# Altium schematic sheet ZLS_Signal_Conditioner.SchDoc
size Tabloid
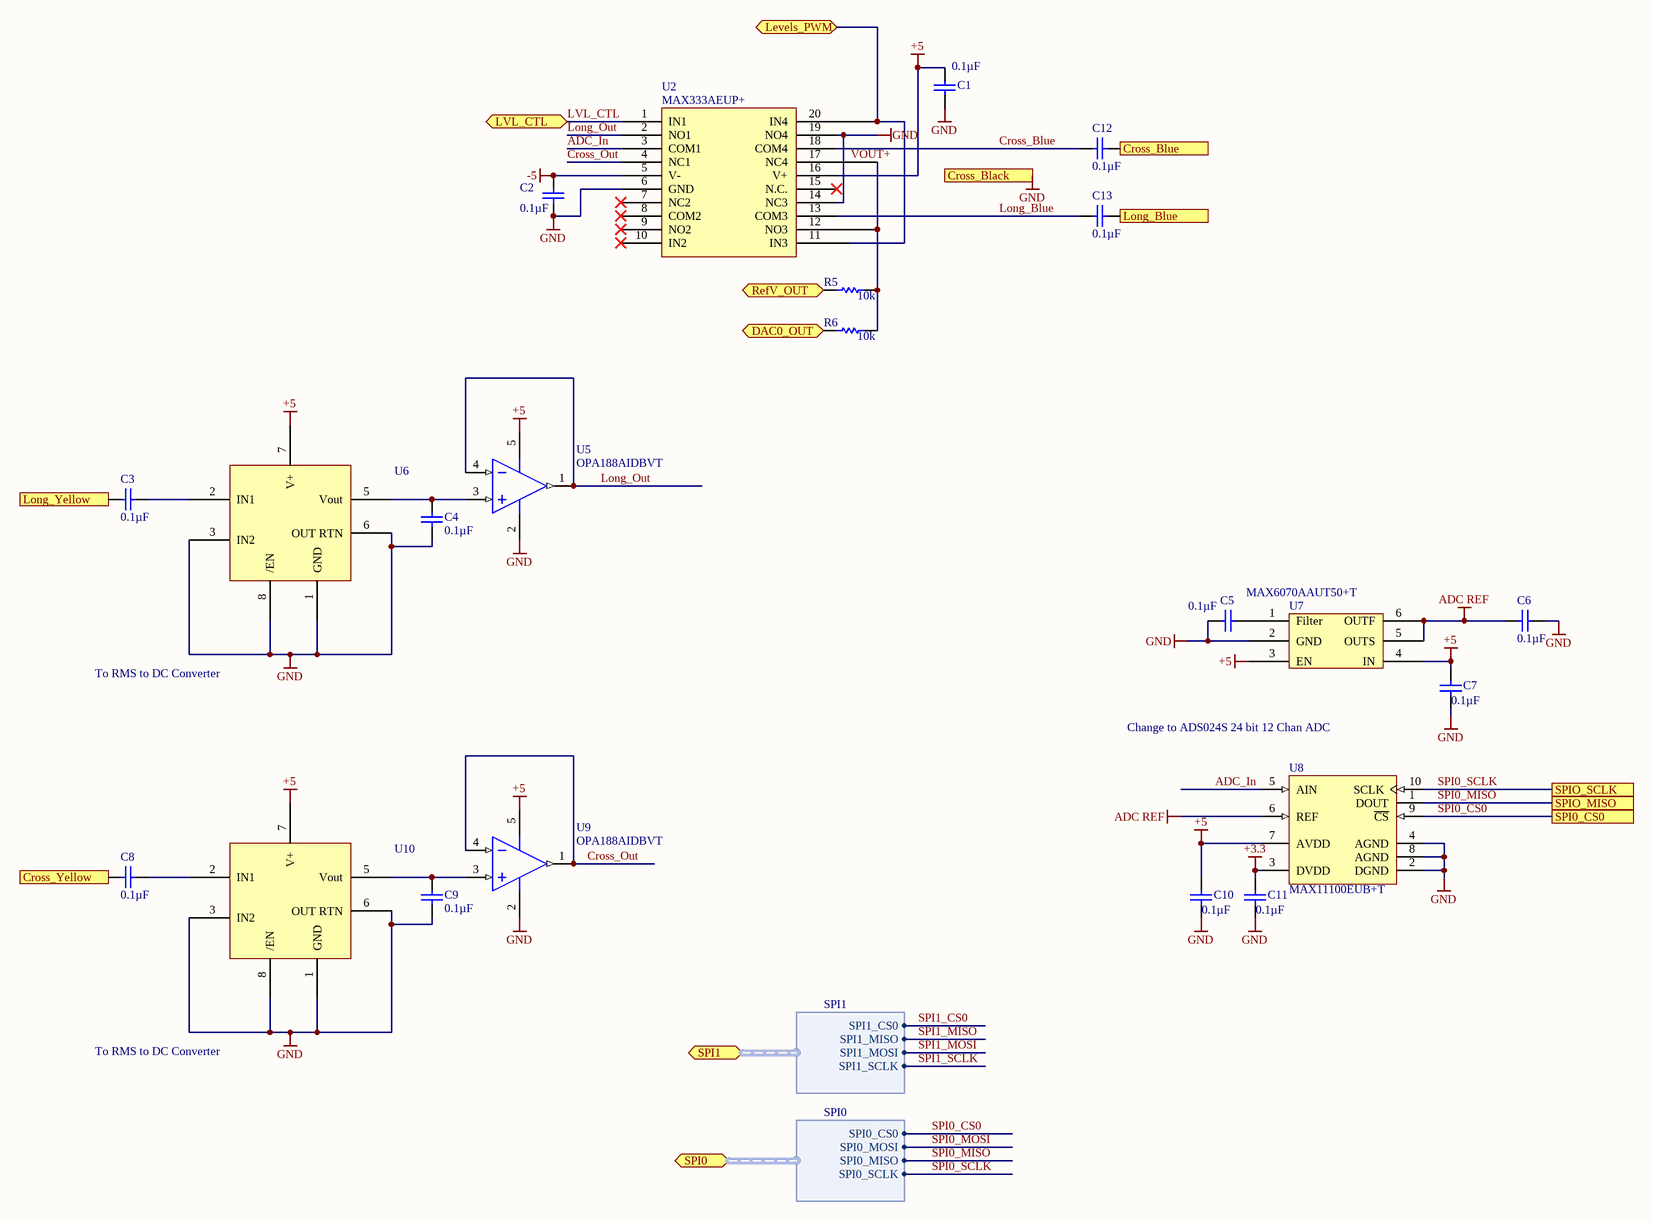
[diagram p0: ZLS_Signal_Conditioner.SchDoc]

## Parts
C1  Capacitance: 0.1µF  [CAPC0805(2012)145_N]  (hidden comment: CAP CER 0.1UF 25V X7R 0805)
C2  Capacitance: 0.1µF  [CAPC0805(2012)145_N]  (hidden comment: CAP CER 0.1UF 25V X7R 0805)
C3  Capacitance: 0.1µF  [CAPC0805(2012)145_N]  (hidden comment: CAP CER 0.1UF 25V X7R 0805)
C4  Capacitance: 0.1µF  [CAPC0805(2012)145_N]  (hidden comment: CAP CER 0.1UF 25V X7R 0805)
C5  Capacitance: 0.1µF  [CAPC0805(2012)145_N]  (hidden comment: CAP CER 0.1UF 25V X7R 0805)
C6  Capacitance: 0.1µF  [CAPC0805(2012)145_N]  (hidden comment: CAP CER 0.1UF 25V X7R 0805)
C7  Capacitance: 0.1µF  [CAPC0805(2012)145_N]  (hidden comment: CAP CER 0.1UF 25V X7R 0805)
C8  Capacitance: 0.1µF  [CAPC0805(2012)145_N]  (hidden comment: CAP CER 0.1UF 25V X7R 0805)
C9  Capacitance: 0.1µF  [CAPC0805(2012)145_N]  (hidden comment: CAP CER 0.1UF 25V X7R 0805)
C10  Capacitance: 0.1µF  [CAPC0805(2012)145_N]  (hidden comment: CAP CER 0.1UF 25V X7R 0805)
C11  Capacitance: 0.1µF  [CAPC0805(2012)145_N]  (hidden comment: CAP CER 0.1UF 25V X7R 0805)
C12  Capacitance: 0.1µF  [CAPC0805(2012)145_N]  (hidden comment: CAP CER 0.1UF 25V X7R 0805)
C13  Capacitance: 0.1µF  [CAPC0805(2012)145_N]  (hidden comment: CAP CER 0.1UF 25V X7R 0805)
R5  10k  [RESC0805(2012)_L]
R6  10k  [RESC0805(2012)_L]
U2  MAX333AEUP+  [TSOP65P640X90-20N]
U5  OPA188AIDBVT  [DBV0005A_L]
U6  LTC1967  [LTC1967]  (value not drawn)
U7  Supplier Part Number 1: MAX6070AAUT50+T  [SOT95P280X445-6N]  (hidden comment: MAX6070AAUT41+T)
U8  MAX11100EUB+T  [U10+2_L]
U9  OPA188AIDBVT  [DBV0005A_L]
U10  LTC1967  [LTC1967]  (value not drawn)

## Ports
Cross_Black, Cross_Blue, Cross_Yellow, DAC0_OUT, Levels_PWM, Long_Blue, Long_Yellow, LVL_CTL, RefV_OUT, SPI0 (harness SPI0), SPI0_CS0, SPI1 (harness SPI1), SPIO_MISO, SPIO_SCLK

## Harnesses
SPI1: SPI1_CS0, SPI1_MISO, SPI1_MOSI, SPI1_SCLK
SPI0: SPI0_CS0, SPI0_MOSI, SPI0_MISO, SPI0_SCLK

## Nets
+3.3: C11.1 U8.3(DVDD)
+5: C1.1 C7.1 C10.1 U2.16(V+) U5.5(V+) U6.7(V+) U7.3(EN) U7.4(IN) U8.7(AVDD) U9.5(V+) U10.7(V+)
-5: C2.1 U2.5(V-)
ADC REF: C6.1 U7.5(OUTS) U7.6(OUTF) U8.6(REF)
GND: C1.2 C2.2 C4.1 C5.1 C6.2 C7.2 C9.1 C10.2 C11.2 U2.6(GND) U2.14(NC3) U2.19(NO4) U5.2(V-) U6.1(GND) U6.3(IN2) U6.6(OUT_RTN) U6.8(/EN) U7.2(GND) U8.2(DGND) U8.4(AGND) U8.8(AGND) U9.2(V-) U10.1(GND) U10.3(IN2) U10.6(OUT_RTN) U10.8(/EN) ; port Cross_Black
ADC_In: U2.3(COM1) U8.5(AIN)
Cross_Blue: C12.1 U2.18(COM4)
Cross_Blue: C12.2 ; port Cross_Blue  [a separate net that carries the same name]
Cross_Out: U2.4(NC1) U9.1(OUT) U9.4(IN-)
Cross_Yellow: C8.1 ; port Cross_Yellow
DAC0_OUT: R6.1 ; port DAC0_OUT
Levels_PWM: U2.11(IN3) U2.20(IN4) ; port Levels_PWM
Long_Blue: C13.1 U2.13(COM3)
Long_Blue: C13.2 ; port Long_Blue  [a separate net that carries the same name]
Long_Out: U2.2(NO1) U5.1(OUT) U5.4(IN-)
Long_Yellow: C3.1 ; port Long_Yellow
LVL_CTL: U2.1(IN1) ; port LVL_CTL
RefV_OUT: R5.1 ; port RefV_OUT
SPI0_CS0: U8.9(~{CS}) ; port SPI0_CS0, port SPI0.SPI0_CS0
SPI0_MISO: U8.1(DOUT) ; port SPIO_MISO, port SPI0.SPI0_MISO
SPI0_MOSI: port SPI0.SPI0_MOSI
SPI0_SCLK: U8.10(SCLK) ; port SPIO_SCLK, port SPI0.SPI0_SCLK
SPI1_CS0: port SPI1.SPI1_CS0
SPI1_MISO: port SPI1.SPI1_MISO
SPI1_MOSI: port SPI1.SPI1_MOSI
SPI1_SCLK: port SPI1.SPI1_SCLK
VOUT+: R5.2 R6.2 U2.12(NO3) U2.17(NC4)
NetC3_2: C3.2 U6.2(IN1)
NetC4_2: C4.2 U5.3(IN+) U6.5(Vout)
NetC5_2: C5.2 U7.1(Filter)
NetC8_2: C8.2 U10.2(IN1)
NetC9_2: C9.2 U9.3(IN+) U10.5(Vout)

Not connected (* = marked no-connect by the designer): U2 7(NC2)* 8(COM2)* 9(NO2)* 10(IN2)* 15(N.C.)*; U6 4(NC); U10 4(NC)

## Notes on the sheet
- To RMS to DC Converter
- Change to ADS024S 24 bit 12 Chan ADC
- Title
- Size:
- Date:
- Tabloid
- Number:
- Time:
- Revision:
- Sheet
- of
- ZLS Corporation
- 7801 North Lamar Blvd.
- Suite E-184
- Austin, Texas 78752  USA
- (512) 453-0288
- File:

## Library data of the parts
C1-C13 = CMP-1036-04795-1: Manufacturer: Murata Electronics North America; Manufacturer Part Number: GRM21BR71E104KA01L; Tolerance: ±10%; Supplier 1: Digi-Key; Supplier Part Number 1: 490-1673-6-ND; RoHS: RoHS Compliant; Category: Capacitors; Stock 1: 891652; Pricing 1: 1=0.2, 10=0.145, 100=0.0683, 500=0.04788, 1000=0.03964 (USD); Packaging: Digi-Reel®; Part Status: Active; Voltage - Rated: 25V; Temperature Coefficient: X7R; Operating Temperature: -55°C ~ 125°C; Features: -; Ratings: -; Applications: General Purpose; Mounting Type: Surface Mount, MLCC; Package / Case: 0805 (2012 Metric); Size / Dimension: 0.079" L x 0.049" W (2.00mm x 1.25mm); Height - Seated (Max): -; Thickness (Max): 0.053" (1.35mm); Lead Spacing: -; Lead Style: -; ComponentLink1URL: http://www.murata.com/~/media/webrenewal/support/library/catalog/products/capacitor/mlcc/c02e.ashx; ComponentLink1Description: http://www.murata.com/~/media/webrenewal/support/library/catalog/products/capacitor/mlcc/c02e.ashx
R5 R6 = CMP-1013-00393-1: RES SMD 0 OHM 1% 1/8W 0805
U2 = MAX333CWP+: IC SWITCH QUAD SPDT 20TSSOP; Manufacturer: Maxim Integrated; Multiplexer/Demultiplexer Circuit: 2:1; On-State Resistance (Max): 45 Ohm; Channel-to-Channel Matching (&Delta;Ron): 2 Ohm (Max); Voltage - Supply, Single (V+): 10 V ~ 30 V; Voltage - Supply, Dual (V±): ±4.5 V ~ 20 V; Switch Time (Ton, Toff) (Max): 175ns, 145ns; Charge Injection: 2pC; Channel Capacitance (CS(off), CD(off)): 5pF; Current - Leakage (IS(off)) (Max): 250pA; Crosstalk: -78dB @ 1MHz; Supplier 1: Digi-Key; Supplier Part Number 1: MAX333AEUP+-ND; Manufacturer Part Number: MAX333AEUP+; RoHS: RoHS Compliant; Category: Integrated Circuits (ICs); Stock 1: 1328; Pricing 1: 1=6.77, 10=6.432, 25=6, 50=5.8942 (USD); Packaging: Tube; Part Status: Active; Switch Circuit: SPDT; -3db Bandwidth: -; Operating Temperature: -40°C ~ 85°C (TA); Package / Case: 20-TSSOP (0.173", 4.40mm Width); Supplier Device Package: 20-TSSOP; Base Part Number: MAX333; ComponentLink1URL: https://pdfserv.maximintegrated.com/en/ds/MAX333A.pdf; ComponentLink1Description: https://pdfserv.maximintegrated.com/en/ds/MAX333A.pdf
U5 U9 = CMP-0809-00006-2: Precision, Low Noise, Rail-to-Rail Output, Zero-Drift Operational Amplifier, 4 to 36 V, -40 to 125 degC, 5-pin SOT23 (DBV5), Green (RoHS & no Sb/Br); Manufacturer: Texas Instruments; Iq per channel(Max)(mA): 0.51; Total Supply Voltage(Max)(+5V is 5, +/-5V is 10): 36; GBW(Typ)(MHz): 2; SubFamily: Zero Drift Precision Amplifier; Rating: Catalog; CMRR(Min)(dB): 120; Number of Channels: 1; Slew Rate(Typ)(V/us): 0.8; Total Supply Voltage(Min)(+5V is 5, +/-5V is 10): 4; Offset Drift(Typ)(uV/C): 0.03; PackageDescription: 5-Pin Plastic Small Outline, Body 1.6 x 2.9 mm, Pitch 0.95 mm; PackageReference: DBV0005A; ComponentLink3Description: Package Specification; ComponentLink3URL: http://www.ti.com/litv/pdf/mpds018i; Mounting Technology: Surface Mount; ComponentLink2URL: http://www.ti.com/lit/ds/symlink/opa188.pdf; Code_JEDEC: MO-178; PackageVersion: 4073253-4/K, 03/2006; ComponentLink2Description: Datasheet; DatasheetVersion: SBOS642A; ComponentLink1URL: http://www.ti.com/; ComponentLink1Description: Manufacturer URL; Eco-Plan: Green (RoHS & no Sb/Br); PartNumber: OPA188AIDBVT
U6 U10 = LTC1967: IC CONVERTER RMS-DC PREC 9MSOP
U7 = MAX6070AAUT41+T: IC VREF SERIES 5V SOT23-6; Manufacturer: Maxim; Description: Voltage References Filtered 5V .04% Accuracy VR; Tolerance: 0.04%; Number of Channels: 1; Max Input Voltage: 5.5V; Min Input Voltage: 2.7V; Temperature Coefficient: 6ppm/°C; Quiescent Current: 250uA; Output Current: 10mA; Operating Supply Current: 330uA; Output Type: Fixed; Supplier 1: Avnet; Manufacturer Part Number: MAX6070AAUT50+T; Stock 1: 2500; Pricing 1: 2500=1.69, 5000=1.69, 10000=1.59, 15000=1.59, 25000=1.49 (USD); Mount: Surface Mount; Case/Package: SOT-23-6; Min Operating Temperature: -40°C; Max Operating Temperature: 125°C; Package Quantity: 2500; Packaging: Tape and Reel; Output Voltage: 5V; Min Output Voltage: 5V; Reference Type: Series; ComponentLink1URL: http://www.mouser.com/ds/2/256/MAX6070-MAX6071-217862.pdf?src-supplier=Mouser; ComponentLink1Description: http://www.mouser.com/ds/2/256/MAX6070-MAX6071-217862.pdf?src-supplier=Mouser; ComponentLink2URL: https://media.digikey.com/pdf/Data%20Sheets/Maxim%20PDFs/PartNumberBreakdown_ds.pdf?src-supplier=Digi-Key; ComponentLink2Description: https://media.digikey.com/pdf/Data%20Sheets/Maxim%20PDFs/PartNumberBreakdown_ds.pdf?src-supplier=Digi-Key
U8 = CMP-0249-00017-1: 16-Bit, +5V, 200ksps ADC with 10uA Shutdown, 10-Pin uMAX, -40°C to +85°C, Pb-Free, Tape and Reel; DatasheetVersion: Rev 1, Jan-2012; ComponentLink3URL: http://pdfserv.maxim-ic.com/package_dwgs/21-0061.PDF; PackageReference: U10+2; ComponentLink2URL: http://datasheets.maxim-ic.com/en/ds/MAX11100.pdf; PackageVersion: revL, 2008; ComponentLink1Description: Manufacturer URL; Code_JEDEC: MO-187-BA; ComponentLink1URL: http://www.maxim-ic.com; ComponentLink3Description: Package Specification; PackageDescription: 10-Pin Micro-MAX Thin Shrink Small Outline (uSOP), 3 x 3 x 0.85 mm Body, 0.5 mm Pitch, Pb-Free; ComponentLink2Description: Datasheet